# EAGLE schematic WiringSchematic (EAGLE 9.5.2)
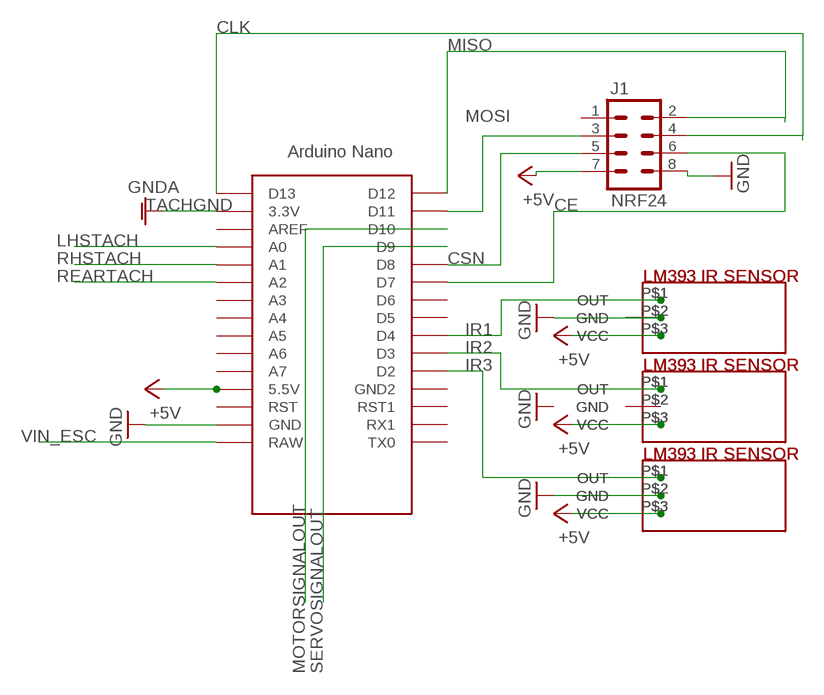
[diagram p0: schematic, sheet 1]

## Parts
J1  NRF24  M04X2  [2X4]
U$1  NANO  [NANO]
U$2  LM  [LM]  (not placed on a sheet)
U$3  LM  [LM]
U$4  LM  [LM]
U$5  LM  [LM]
U$6  LM  [LM]
U$7  LM  [LM]
U$8  LM  [LM]

## Nets
+5V: J1.7 U$1.5V(5.5V) U$3.P$3(VCC) U$4.P$3(VCC) U$5.P$3(VCC) U$6.P$3(VCC) U$7.P$3(VCC) U$8.P$3(VCC)
CE: J1.6 U$1.D7
CLK: J1.4 U$1.D13
CSN: J1.5 U$1.D8
GND: J1.8 U$1.GND U$3.P$2(GND) U$5.P$2(GND) U$6.P$2(GND) U$8.P$2(GND)
IR1: U$1.D4 U$3.P$1(OUT) U$6.P$1(OUT)
IR2: U$1.D3 U$4.P$1(OUT) U$7.P$1(OUT)
IR3: U$1.D2 U$5.P$1(OUT) U$8.P$1(OUT)
LHSTACH: U$1.A0
MISO: J1.2 U$1.D12
MOSI: J1.3 U$1.D11
MOTORSIGNALOUT: U$1.D10
N$6: U$4.P$2(GND) U$7.P$2(GND)
REARTACH: U$1.A2
RHSTACH: U$1.A1
SERVOSIGNALOUT: U$1.D9
TACHGND: U$1.3.3V ; supply symbol labelled GNDA
VIN_ESC: U$1.RAW
Unconnected: J1.1 U$1.A3 U$1.A4 U$1.A5 U$1.A6 U$1.A7 U$1.AREF U$1.D5 U$1.D6 U$1.GND1(GND2) U$1.ICSP1 U$1.ICSP2 U$1.ICSP3 U$1.ICSP4 U$1.ICSP5 U$1.ICSP6 U$1.RST U$1.RST1 U$1.RX1 U$1.TX0 U$2.P$1(OUT) U$2.P$2(GND) U$2.P$3(VCC)

## Library data of the parts
J1 = SparkFun-Connectors:M04X2: .1" header, two rows of four.
U$1 = Arduino-clone:NANO: Arduino Nano
U$2-U$8 = lm393:LM